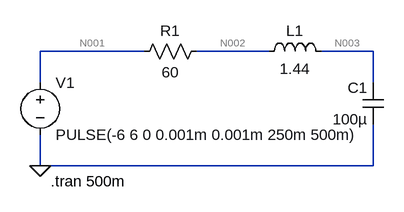
[diagram p0: schematic RLC.asc]
RLC.asc, the LTspice schematic file:
Version 4.1
SHEET 1 880 680
WIRE 112 96 -48 96
WIRE 304 96 192 96
WIRE 464 96 384 96
WIRE -48 144 -48 96
WIRE 464 144 464 96
WIRE -48 272 -48 224
WIRE 464 272 464 208
WIRE 464 272 -48 272
FLAG -48 272 0
SYMBOL voltage -48 128 R0
WINDOW 123 0 0 Left 0
WINDOW 39 0 0 Left 0
SYMATTR InstName V1
SYMATTR Value PULSE(-6 6 0 0.001m 0.001m 250m 500m)
SYMBOL res 208 80 R90
WINDOW 0 0 56 VBottom 2
WINDOW 3 32 56 VTop 2
SYMATTR InstName R1
SYMATTR Value 60
SYMBOL cap 480 208 R180
WINDOW 0 24 56 Left 2
WINDOW 3 24 8 Left 2
SYMATTR InstName C1
SYMATTR Value 100µ
SYMBOL ind 288 112 R270
WINDOW 0 32 56 VTop 2
WINDOW 3 5 56 VBottom 2
SYMATTR InstName L1
SYMATTR Value 1.44
SYMATTR SpiceLine Rser=0
TEXT -32 296 Left 2 !.tran 500m

The netlist it stands for:
* RLC.asc
V1 N001 0 PULSE(-6 6 0 0.001m 0.001m 250m 500m)
R1 N002 N001 60
C1 0 N003 100µ
L1 N002 N003 1.44 Rser=0
.tran 500m
.backanno
.end

* Results of the author's LTspice run, read from the files saved beside the schematic
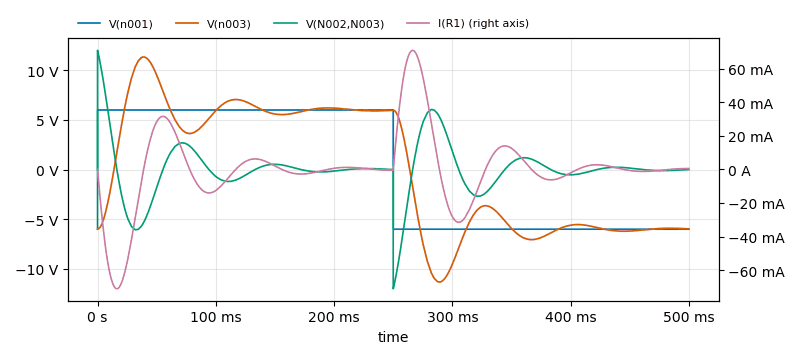
[diagram p1: Transient Analysis of RLC.asc, plotted from the saved traces]
* Transient Analysis, 1 run:
*   V(n001): min -6 V, max 6 V, average 24 µV, rms 6 V, last -6 V
*   V(n003): min -11.32 V, max 11.33 V, average 1.347 mV, rms 6.414 V, last -5.967 V
*   V(N002,N003): min -12 V, max 12 V, average -1.715 mV, rms 2.627 V, last -230.8 µV
*   I(R1): min -71.16 mA, max 70.95 mA, average -6.525 µA, rms 21.9 mA, last 547 µA